# EAGLE design PowerBoard (EAGLE 7.3.0)
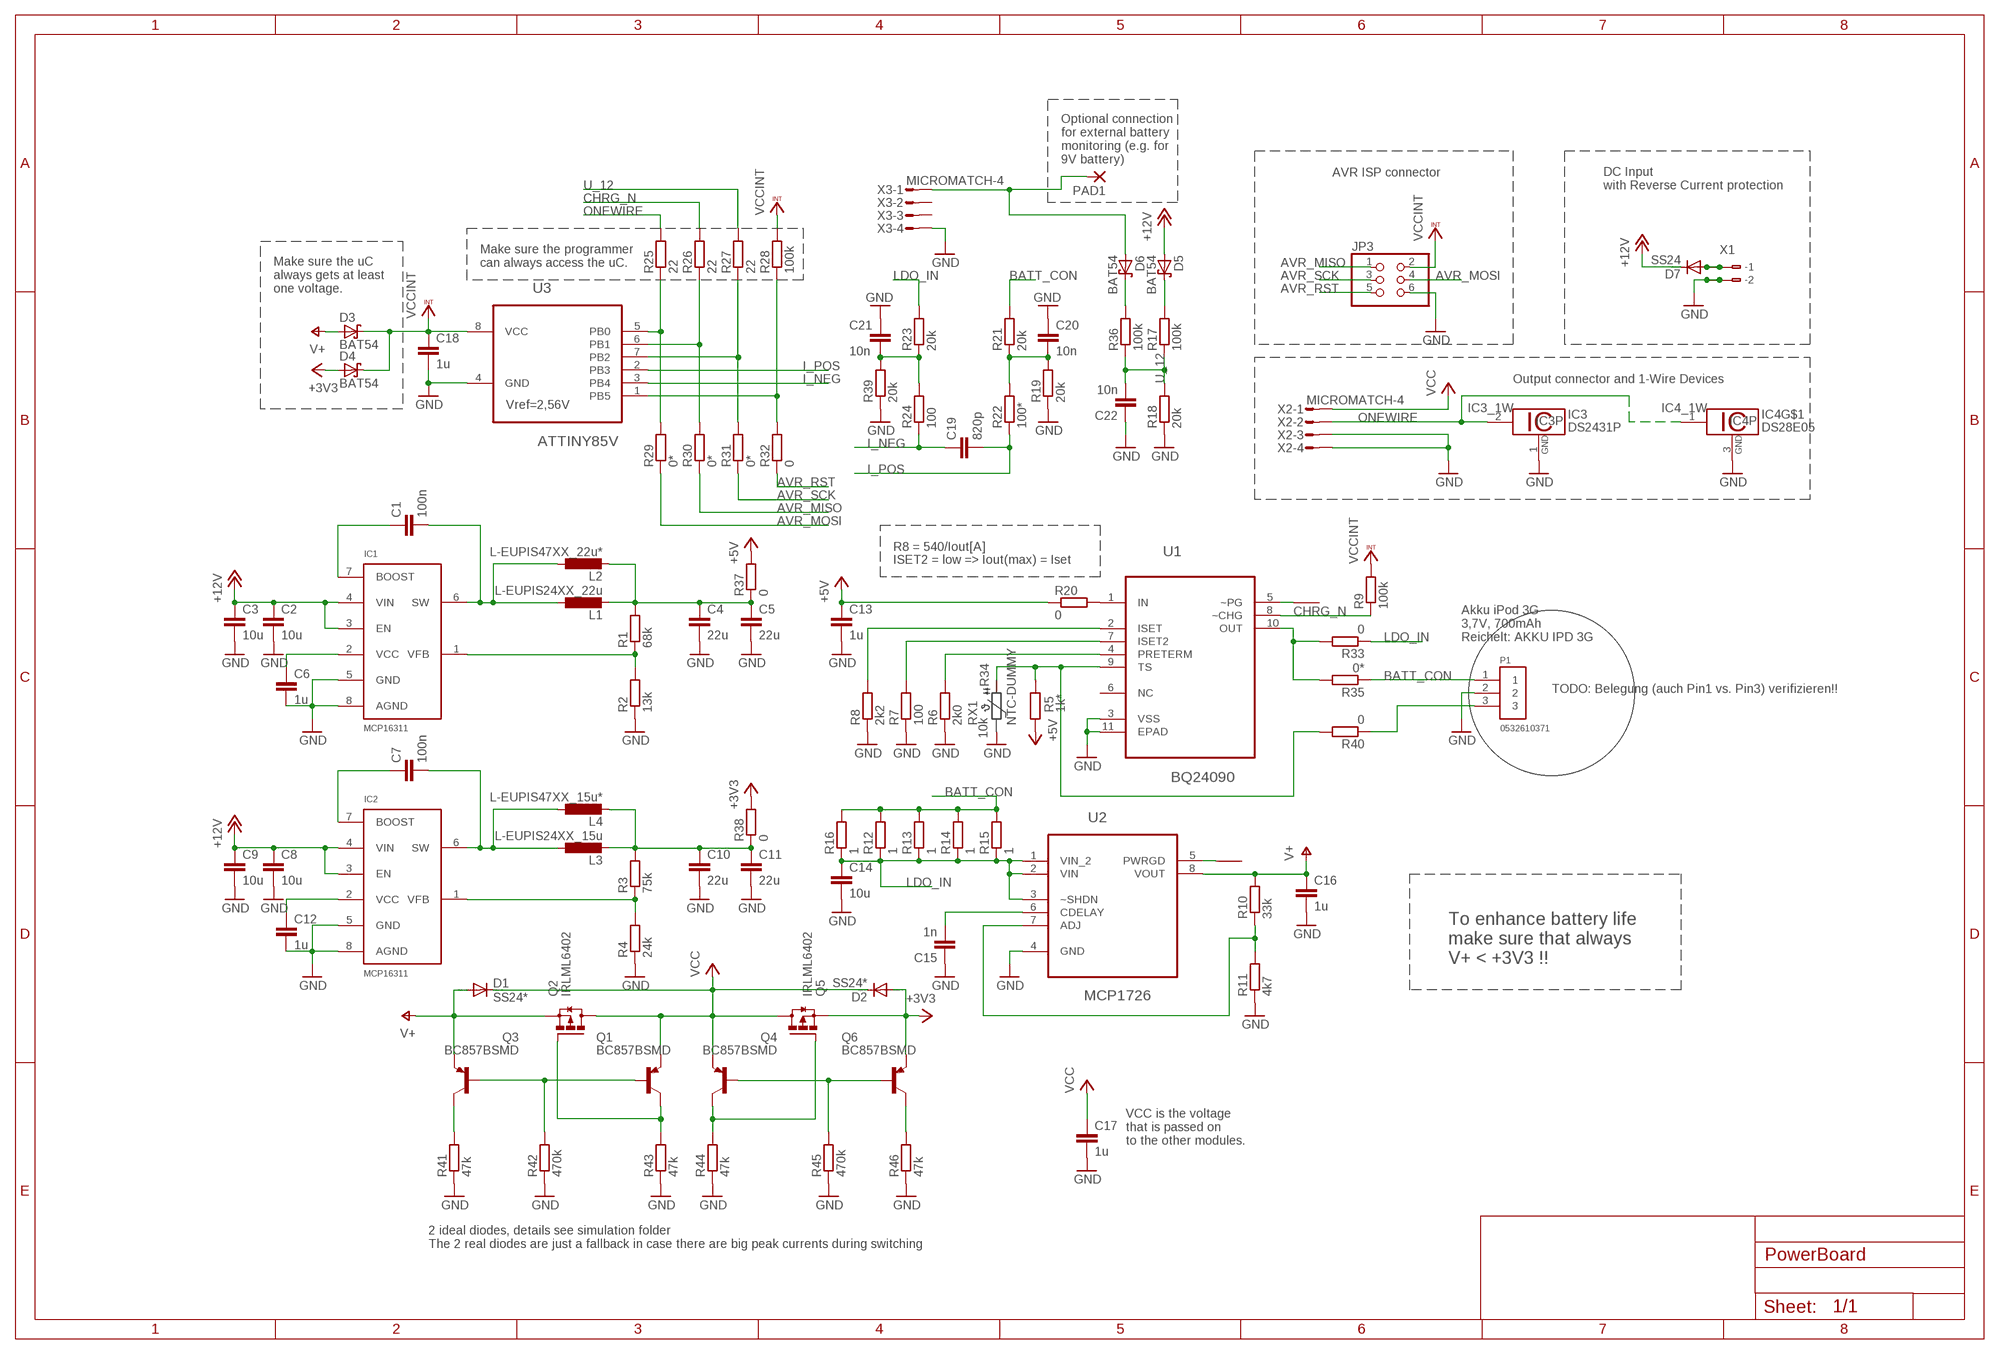
[diagram p0: schematic, sheet 1]

## Parts
C1  100n  C-EUC0603  [C0603]
C2  10u  C-EUC1210  [C1210]
C3  10u  C-EUC1210  [C1210]
C4  22u  C-EUC1210  [C1210]
C5  22u  C-EUC1210  [C1210]
C6  1u  C-EUC0603  [C0603]
C7  100n  C-EUC0603  [C0603]
C8  10u  C-EUC1210  [C1210]
C9  10u  C-EUC1210  [C1210]
C10  22u  C-EUC1210  [C1210]
C11  22u  C-EUC1210  [C1210]
C12  1u  C-EUC0603  [C0603]
C13  1u  C-EUC0603  [C0603]
C14  10u  C-EUC1210  [C1210]
C15  1n  C-EUC0603  [C0603]
C16  1u  C-EUC0603  [C0603]
C17  1u  C-EUC0603  [C0603]
C18  1u  C-EUC0603  [C0603]
C19  820p  C-EUC0603  [C0603]
C20  10n  C-EUC0603  [C0603]
C21  10n  C-EUC0603  [C0603]
C22  10n  C-EUC0603  [C0603]
D1  SS24*  DIODE-SMB  [SMB]
D2  SS24*  DIODE-SMB  [SMB]
D3  BAT54  [SOT23]
D4  BAT54  [SOT23]
D5  BAT54  [SOT23]
D6  BAT54  [SOT23]
D7  SS24  DIODE-SMB  [SMB]
IC1  MCP16311  [SOP65P490X110-8N]
IC2  MCP16311  [SOP65P490X110-8N]
IC3  DS2431P  [TSOC6]
IC4  DS28E05  [SOT23]
JP3  PINHD-2X3  [2X03]
L1  L-EUPIS24XX_22u  L-EUPIS24XX  [PIS24XX]
L2  L-EUPIS47XX_22u*  L-EUPIS47XX  [PIS47XX]
L3  L-EUPIS24XX_15u  L-EUPIS24XX  [PIS24XX]
L4  L-EUPIS47XX_15u*  L-EUPIS47XX  [PIS47XX]
P1  0532610371  [MOLEX_0532610371]
PAD1  WIREPADSMD2,54-5,08  [SMD2,54-5,08]
Q1  BC857BSMD  [SOT23-BEC]
Q2  IRLML6402  [SOT23]
Q3  BC857BSMD  [SOT23-BEC]
Q4  BC857BSMD  [SOT23-BEC]
Q5  IRLML6402  [SOT23]
Q6  BC857BSMD  [SOT23-BEC]
R1  68k  R-EU_R0603  [R0603]
R2  13k  R-EU_R0603  [R0603]
R3  75k  R-EU_R0603  [R0603]
R4  24k  R-EU_R0603  [R0603]
R5  1k*  R-EU_R0603  [R0603]
R6  2k0  R-EU_R0603  [R0603]
R7  100  R-EU_R0603  [R0603]
R8  2k2  R-EU_R0603  [R0603]
R9  100k  R-EU_R0603  [R0603]
R10  33k  R-EU_R0603  [R0603]
R11  4k7  R-EU_R0603  [R0603]
R12  1  R-EU_R0402  [R0402]
R13  1  R-EU_R0402  [R0402]
R14  1  R-EU_R0402  [R0402]
R15  1  R-EU_R0402  [R0402]
R16  1  R-EU_R0402  [R0402]
R17  100k  R-EU_R0603  [R0603]
R18  20k  R-EU_R0603  [R0603]
R19  20k  R-EU_R0603  [R0603]
R20  0  R-EU_R0603  [R0603]
R21  20k  R-EU_R0603  [R0603]
R22  100*  R-EU_R0603  [R0603]
R23  20k  R-EU_R0603  [R0603]
R24  100  R-EU_R0603  [R0603]
R25  22  R-EU_R0402  [R0402]
R26  22  R-EU_R0402  [R0402]
R27  22  R-EU_R0402  [R0402]
R28  100k  R-EU_R0402  [R0402]
R29  0*  R-EU_R0402  [R0402]
R30  0*  R-EU_R0402  [R0402]
R31  0*  R-EU_R0402  [R0402]
R32  0  R-EU_R0402  [R0402]
R33  0  R-EU_R0603  [R0603]
R34  10k  R-EU_R0603  [R0603]
R35  0*  R-EU_R0603  [R0603]
R36  100k  R-EU_R0603  [R0603]
R37  0  R-EU_R0603  [R0603]
R38  0  R-EU_R0603  [R0603]
R39  20k  R-EU_R0603  [R0603]
R40  0  R-EU_R0603  [R0603]
R41  47k  R-EU_R0603  [R0603]
R42  470k  R-EU_R0603  [R0603]
R43  47k  R-EU_R0603  [R0603]
R44  47k  R-EU_R0603  [R0603]
R45  470k  R-EU_R0603  [R0603]
R46  47k  R-EU_R0603  [R0603]
U1  BQ24090  BQ24090DGQT  [SOP50P490X110-11N]
U2  MCP1726  MCP1726-3302E/SN  [SOIC127P490X175-8N]
U3  ATTINY85V  ATTINY85V-10SU  [SOIC127P798X216-8N]
U$1  PAD100-RND  [PAD-100-RND]
U$3  PAD100-RND  [PAD-100-RND]
X1  233-102  [233-102]
X2  MICROMATCH-4  [MICROMATCH-4]
X3  MICROMATCH-4  [MICROMATCH-4]

## Nets
+3V3: D2.A D4.1(A) Q5.2(S) Q6.E R38.2
+5V: C13.1 R5.1 R20.1 R37.2
+12V: C2.1 C3.1 C8.1 C9.1 D5.1(A) D7.C IC1.3(EN) IC1.4(VIN) IC2.3(EN) IC2.4(VIN)
AVR_MISO: JP3.1 R30.1
AVR_MOSI: JP3.4 R29.1
AVR_RST: JP3.5 R32.1
AVR_SCK: JP3.3 R31.1
BATT_CON: P1.1 R12.2 R13.2 R14.2 R15.2 R16.2 R21.2 R35.1
CHRG_N: R9.1 R26.2 U1.8(~CHG)
GND: C2.2 C3.2 C4.2 C5.2 C6.2 C8.2 C9.2 C10.2 C11.2 C12.2 C13.2 C14.2 C15.1 C16.2 C17.2 C18.2 C20.1 C21.1 C22.1 IC1.5(GND) IC1.8(AGND) IC2.5(GND) IC2.8(AGND) IC3.1(GND) IC4.3(P:GND) JP3.6 P1.2 R2.1 R4.1 R6.1 R7.1 R8.1 R11.1 R18.1 R19.1 R34.1 R39.1 R41.1 R42.1 R43.1 R44.1 R45.1 R46.1 U1.3(VSS) U1.11(EPAD) U2.4(GND) U3.4(GND) X1.A2(-2) X1.B2(B-2) X2.3 X2.4 X3.4
I_NEG: C19.1 R24.1 U3.3(PB4)
I_POS: C19.2 R22.1 U3.2(PB3)
LDO_IN: C14.1 R12.1 R13.1 R14.1 R15.1 R16.1 R23.2 R33.1 U2.1(VIN_2) U2.2(VIN) U2.3(~SHDN)
N$1: C1.1 IC1.7(BOOST)
N$2: C1.2 IC1.6(SW) L1.2 L2.2
N$3: U2.5(PWRGD) U$3.P$1
N$4: R8.2 U1.2(ISET)
N$5: IC1.1(VFB) R1.1 R2.2
N$6: R7.2 U1.7(ISET2)
N$7: C6.1 IC1.2(VCC)
N$8: R6.2 U1.4(PRETERM)
N$9: C7.1 IC2.7(BOOST)
N$10: C7.2 IC2.6(SW) L3.2 L4.2
N$11: IC2.1(VFB) R3.1 R4.2
N$12: C12.1 IC2.2(VCC)
N$13: R5.2 R34.2 R40.2 U1.9(TS)
N$14: U1.5(~PG) U$1.P$1
N$15: C15.2 U2.6(CDELAY)
N$16: R28.1 R32.2 U3.1(PB5)
N$17: D6.3(C) R36.2
N$18: R27.1 R31.2 U3.7(PB2)
N$19: R26.1 R30.2 U3.6(PB1)
N$20: R10.1 R11.2 U2.7(ADJ)
N$21: C21.2 R23.1 R24.2 R39.2
N$22: D7.A X1.A1(-1) X1.B1(B-1)
N$23: R25.1 R29.2 U3.5(PB0)
N$24: D6.1(A) PAD1.1(P) X3.1
N$25: C4.1 C5.1 L1.1 L2.1 R1.2 R37.1
N$26: C10.1 C11.1 L3.1 L4.1 R3.2 R38.1
N$27: C20.2 R19.2 R21.1 R22.2
N$28: D5.3(C) R17.2
N$29: R20.2 U1.1(IN)
N$30: R33.2 R35.2 U1.10(OUT)
N$31: P1.3 R40.1
N$33: Q1.C Q2.1(G) R43.2
N$34: Q1.B Q3.B R42.2
N$35: Q3.C R41.2
N$37: Q4.C Q5.1(G) R44.2
N$38: Q4.B Q6.B R45.2
N$39: Q6.C R46.2
ONEWIRE: IC3.2(1W) IC4.1(_1W:1W) R25.2 X2.2
U_12: C22.2 R17.1 R18.2 R27.2 R36.1
V+: C16.1 D1.A D3.1(A) Q2.2(S) Q3.E R10.2 U2.8(VOUT)
VCC: C17.1 D1.C D2.C Q1.E Q2.3(D) Q4.E Q5.3(D) X2.1
VCCINT: C18.1 D3.3(C) D4.3(C) JP3.2 R9.2 R28.2 U3.8(VCC)
Unconnected: U1.6(NC) X3.2 X3.3

## Notes on the sheet
- Optional connection 
  for external battery
  monitoring (e.g. for 
  9V battery)
- AVR ISP connector
- DC Input
  with Reverse Current protection
- Make sure the programmer
  can always access the uC.
- Make sure the uC
  always gets at least
  one voltage.
- Output connector and 1-Wire Devices
- Vref=2,56V
- R8 = 540/Iout[A]
- ISET2 = low => Iout(max) = Iset
- Akku iPod 3G
  3,7V, 700mAh
  Reichelt: AKKU IPD 3G
- TODO: Belegung (auch Pin1 vs. Pin3) verifizieren!!
- To enhance battery life
  make sure that always
  V+ < +3V3 !!
- VCC is the voltage
  that is passed on
  to the other modules.
- 2 ideal diodes, details see simulation folder
  The 2 real diodes are just a fallback in case there are big peak currents during switching

## Library data of the parts
C1-C22 = rcl:C-EU: CAPACITOR, European symbol
D1 D2 D7 = diode:DIODE-: DIODE
D3-D6 = diode:BAT54: Schottky Diodes Source: Fairchild .. BAT54.pdf
IC1 IC2 = mcp16311_SOP65P490X110-8N:MCP16311
IC3 = 1wire:DS2431: 1024-Bit EEPROM This chip provides a 4x256 Bit EEPROM, which can be programmed@5V. Write protection and OTP emulation are available, too. Author: Jan Kandziora <jjj@gmx.de>
IC4 = 1wire:DS28E05
JP3 = pinhead:PINHD-2X3: PIN HEADER
L1-L4 = Inductor-Fastron:L-EU
P1 = 0532610371:0532610371: 1.25mm (.049") Pitch PicoBlade Header, Surface Mount, Right Angle, Lead-free, 3 Circuits; AVAILABILITY: Good; DESCRIPTION: CONN HEADER 3POS 1.25MM R/A SMD; MF: Molex; MP: 0532610371; PACKAGE: None; PRICE: 0.61 USD
PAD1 = wirepad:WIREPAD: Wire PAD connect wire on PCB
Q1 Q3 Q4 Q6 = transistor-pnp:BC857*: PNP Transistror
Q2 Q5 = IRLML6402:IRLML6402: Single P-Channe MOSFET
R1-R46 = rcl:R-EU_: RESISTOR, European symbol
U1 = BQ24090DGQT:BQ24090DGQT: 1A, Single-Input, Single Cell Li-Ion Battery Charger; AVAILABILITY: Good; DESCRIPTION: 1A%2C Single Input%2C Single Cell Li-Ion Battery Charger w/ 10k%3F NTC %7C Li-ion Linear Battery Charger IC 10-MSOP-PowerPAD ...; MF: Texas Instruments; MP: BQ24090DGQT; PACKAGE: MSOP-10 Texas Instruments; PRICE: 0.96 USD
U2 = MCP1726-3302E_SN:MCP1726-3302E/SN: Current LDO Regulator; AVAILABILITY: Good; DESCRIPTION: MCP1726 Series 1 A 3.3 V Fixed Output Surface Mount LDO Regulator - SOIC-8; MF: Microchip; MP: MCP1726-3302E/SN; PACKAGE: SOIC-8 Microchip; PRICE: 0.63 USD
U3 = ATTINY85V-10SU:ATTINY85V-10SU: 8-bit Microcontroller with In-System Programmable Flash; AVAILABILITY: Good; DESCRIPTION: ATtiny Series 10 MHz 8 KB Flash 512 B SRAM 8-Bit Microcontroller - SOIC-8; MF: Atmel; MP: ATTINY85V-10SU; PACKAGE: SOIC-8 Atmel; PRICE: 1.19 USD
U$1 U$3 = Pinoccio:PAD
X1 = con-wago:233-102: WAGO Cage Clamp; MPN: 233-102; OC_FARNELL: unknown; OC_NEWARK: 28K9044
X2 X3 = con-amp-micromatch:MICROMATCH-4: MicroMaTch 4 7-215464-4 / 0-215464-4 Drawing Number C-215464 DDEController.pdf; MPN: 7-215464-4; OC_FARNELL: 3784629; OC_NEWARK: 19R8124

## Board
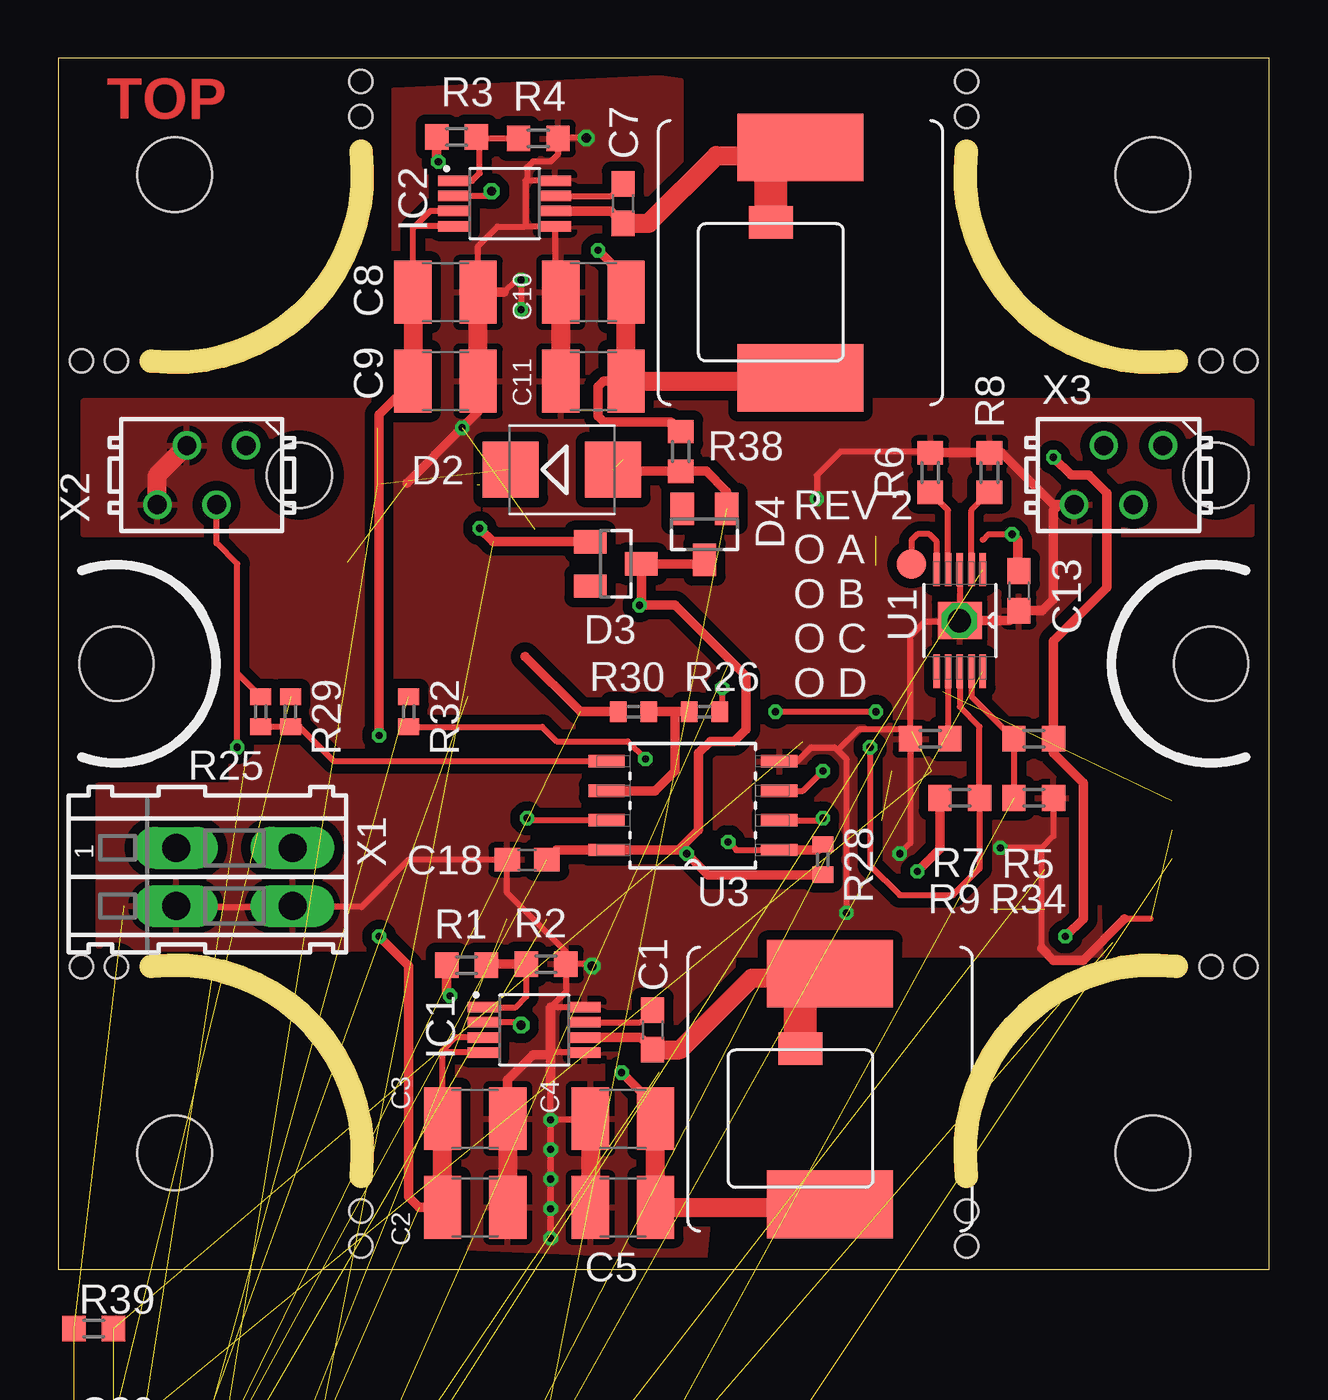
[diagram p1: board, top side]
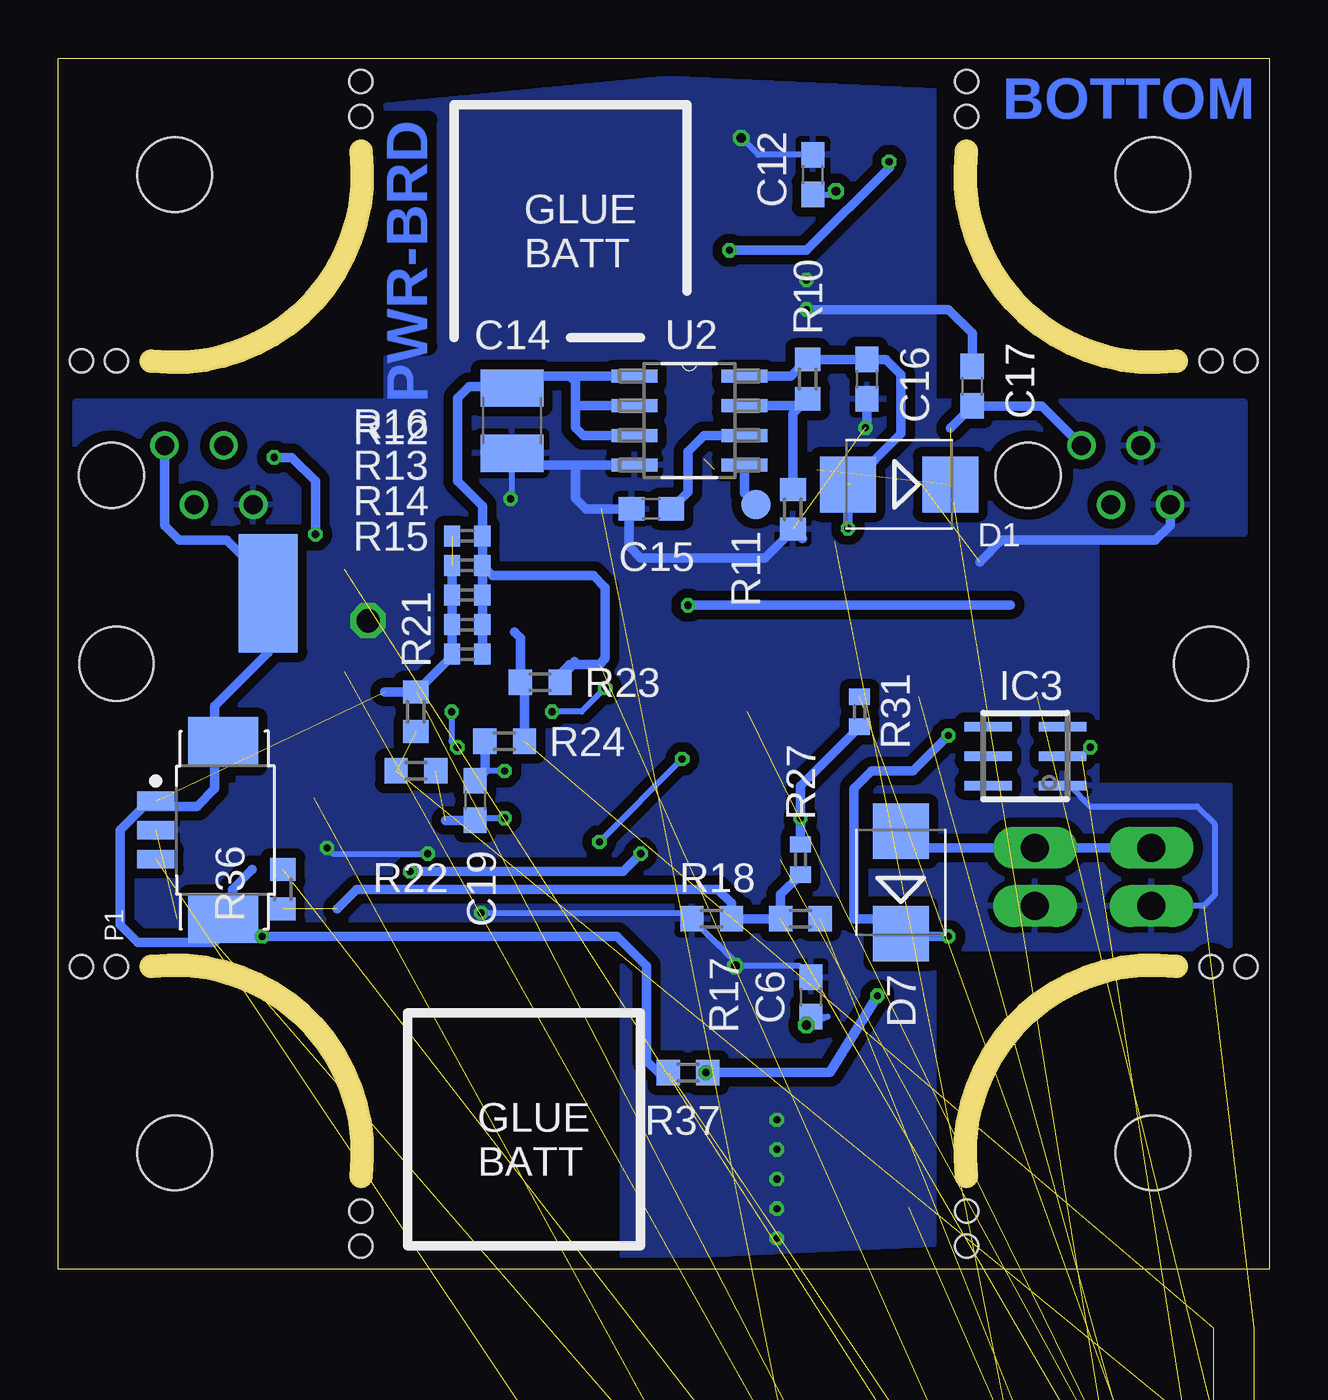
[diagram p2: board, bottom side, seen from below]

Size 52 x 52 mm. Coordinates in mm from the lower left corner, seen from the top.
Outline: 0,0 52,0 52,52 0,52 0,0
Copper layers (1*16): Top 0.035mm / dielectric 1.6mm / Bottom 0.035mm
Design rules "Elecrow_2-layer_PCB_eagle_rule": minimum track width 6mil, minimum drill 12mil, track to track 6mil, track to pad 6mil, pad to pad 6mil, via to via 8mil, smd to smd 0mil, copper to edge 20mil, drill to drill 10mil, minimum pad ring 6mil, minimum via ring 6mil, stop-mask expansion 0mil, vias tented up to drill 100mil, thermal gap 10mil
Holes 3.2 mm at 5,47 47,47 47,5 5,5 2.5,26 49.5,26
Holes 2.8 mm at 10.35,34.1 49.72,34.1
Holes 1 mm at 39,49.5 39,51 49.5,39 51,39 13,49.5 13,51 1,39 2.5,39 1,13 2.5,13 13,1 13,2.5 39,1 39,2.5 51,13 49.5,13
bKeepout: area 35.6,13.3 to 43.2,24.1
Milling: 5 lines

### Footprints (pad centres in the part's own frame; a part is rotated, then mirrored left to right if it is on the bottom)
C0603 = smd 1.1 x 1: 1 -0.85,0; 2 0.85,0
C1210 = smd 1.6 x 2.7: 1 -1.4,0; 2 1.4,0
SMB = smd 2.4 x 2.4: A 2.2,0; C -2.2,0
SOT23 = smd 1 x 1.4: 1 -0.95,-1.1; 2 0.95,-1.1; 3 0,1.1
SOP65P490X110-8N = smd 1.38 x 0.45: 1 -2.165,0.975; 2 -2.165,0.325; 3 -2.165,-0.325; 4 -2.165,-0.975; 5 2.165,-0.975; 6 2.165,-0.325; 7 2.165,0.325; 8 2.165,0.975
TSOC6 = smd 0.406 x 2.032: 1 -1.27,-1.6; 2 0,-1.6; 3 1.27,-1.6; 4 1.27,1.6; 5 0,1.6; 6 -1.27,1.6
2X03 = drill 1.016 octagon: 1 -2.54,-1.27; 2 -2.54,1.27; 3 0,-1.27; 4 0,1.27; 5 2.54,-1.27; 6 2.54,1.27
PIS24XX = smd 1.4 x 1.9: 1 -3,0; 2 3,0
PIS47XX = smd 2.9 x 5.4: 1 -4.95,0; 2 4.95,0
MOLEX_0532610371 = smd 0.8 x 1.6: 1 1.25,0; 2 0,0; 3 -1.25,0 | smd 2.1 x 3: 4 -3.8,-2.9; 5 3.8,-2.9
SMD2,54-5,08 = smd 2.54 x 5.08: 1 0,0
SOT23-BEC = smd 1 x 1.4: B -0.95,-1.1; C 0,1.1; E 0.95,-1.1
R0603 = smd 1 x 1.1: 1 -0.85,0; 2 0.85,0
R0402 = smd 0.7 x 0.9: 1 -0.65,0; 2 0.65,0
SOP50P490X110-11N = smd 1.422 x 0.279: 1 -2.184,0.991; 2 -2.184,0.508; 3 -2.184,0; 4 -2.184,-0.508; 5 -2.184,-0.991; 6 2.184,-0.991; 7 2.184,-0.508; 8 2.184,0; 9 2.184,0.508; 10 2.184,0.991 | smd 1.575 x 1.88: 11 0,0
SOIC127P490X175-8N = smd 1.981 x 0.559: 1 -2.362,1.905; 2 -2.362,0.635; 3 -2.362,-0.635; 4 -2.362,-1.905; 5 2.362,-1.905; 6 2.362,-0.635; 7 2.362,0.635; 8 2.362,1.905
SOIC127P798X216-8N = smd 1.549 x 0.533: 1 -3.708,1.905; 2 -3.708,0.635; 3 -3.708,-0.635; 4 -3.708,-1.905; 5 3.708,-1.905; 6 3.708,-0.635; 7 3.708,0.635; 8 3.708,1.905
PAD-100-RND = smd 1.27 x 1.27: P$1 0,0
233-102 = drill 1.2 long: A1 -1.25,2.5; A2 1.25,2.5; B1 -1.25,-2.5; B2 1.25,-2.5
MICROMATCH-4 = drill 0.813: 1 1.905,1.27; 2 0.635,-1.27; 3 -0.635,1.27; 4 -1.905,-1.27

### Placement (x,y rotation side)
C1  25.52,10.28 270 top
C2  17.9,2.66 0 top
C3  17.9,6.47 0 top
C4  24.25,6.47 180 top
C5  24.25,2.66 180 top
C6  19.68,11.69 90 bottom
C7  24.25,45.76 270 top
C8  16.63,41.95 0 top
C9  16.63,38.14 0 top
C10  22.98,41.95 180 top
C11  22.98,38.14 180 top
C12  19.6,47 90 bottom
C13  41.25,29.13 270 top
C14  32.52,36.44 270 bottom
C15  26.54,32.65 0 bottom
C16  17.28,38.22 270 bottom
C17  12.76,37.92 90 bottom
C18  20.13,17.59 180 top
C19  34.1,20.13 270 bottom
C20  1.52,-7.37 0 top  (outside the outline)
C21  1.52,-12.19 0 top  (outside the outline)
C22  1.52,-17.02 0 top  (outside the outline)
D1  15.89,33.7 180 bottom
D2  21.63,34.33 0 top
D3  23.94,30.29 270 top
D4  27.75,31.56 180 top
D5  2.54,-27.94 0 top  (outside the outline)
D6  2.54,-35.31 0 top  (outside the outline)
D7  15.82,16.61 90 bottom
IC1  20.44,10.28 0 top
IC2  19.17,45.76 0 top
IC3  10.48,22.04 90 bottom
IC4  -5.71,-71.75 0 top  (outside the outline)
JP3  -4.06,-34.04 0 top  (outside the outline)
L1  31.87,6.47 90 top
L2  33.14,7.74 90 top
L3  30.6,41.95 90 top
L4  31.87,43.22 90 top
P1  47.82,18.86 90 bottom
PAD1  42.99,29.02 180 bottom
Q1  -5.71,-79.38 0 top  (outside the outline)
Q2  -5.71,-87 0 top  (outside the outline)
Q3  -5.71,-94.61 0 top  (outside the outline)
Q4  -5.71,-117.47 0 top  (outside the outline)
Q5  -5.71,-135.25 0 top  (outside the outline)
Q6  -5.71,-142.88 0 top  (outside the outline)
R1  17.53,13.06 180 top
R2  20.95,13.11 180 top
R3  17.11,48.62 180 top
R4  20.61,48.55 180 top
R5  41.88,22.78 180 top
R6  37.44,34.21 270 top
R7  37.44,22.78 0 top
R8  39.98,34.21 270 top
R9  38.71,20.24 180 top
R10  19.82,38.22 90 bottom
R11  20.45,32.63 90 bottom
R12  34.44,30.22 180 bottom
R13  34.44,28.95 180 bottom
R14  34.44,27.68 180 bottom
R15  34.44,26.41 180 bottom
R16  34.44,31.49 180 bottom
R17  20.13,15.05 0 bottom
R18  23.94,15.05 0 bottom
R19  1.52,-21.84 0 top  (outside the outline)
R20  -6.86,-41.4 0 top  (outside the outline)
R21  36.64,23.94 90 bottom
R22  36.64,21.4 180 bottom
R23  31.31,25.21 0 bottom
R24  32.83,22.67 0 bottom
R25  8.7,23.94 90 top
R26  27.75,23.94 0 top
R27  20.13,17.59 270 bottom
R28  32.83,17.59 270 top
R29  9.97,23.94 270 top
R30  24.7,23.94 0 top
R31  17.59,23.94 270 bottom
R32  15.05,23.94 270 top
R33  -6.86,-55.88 0 top  (outside the outline)
R34  41.88,20.24 180 top
R35  -6.86,-60.71 0 top  (outside the outline)
R36  42.35,16.32 90 bottom
R37  24.96,8.45 180 bottom
R38  26.73,35.12 270 top
R39  1.52,-2.54 0 top
R40  -6.86,-65.53 0 top  (outside the outline)
R41  -6.35,-100.97 0 top  (outside the outline)
R42  -6.35,-106.05 0 top  (outside the outline)
R43  -6.35,-111.12 0 top  (outside the outline)
R44  -6.35,-123.83 0 top  (outside the outline)
R45  -6.35,-128.91 0 top  (outside the outline)
R46  -6.35,-149.22 0 top  (outside the outline)
U1  38.71,27.86 270 top
U2  24.9,36.44 0 bottom
U3  27.25,19.91 180 top
U$1  36.64,30.29 0 top
U$3  22.04,32.83 0 bottom
X1  7.56,16.85 270 top
X2  6.16,34.1 0 top
X3  45.53,34.1 0 top

### Tracks (layer width: path | path; a pad name or v marks a point on that pad's centre or on a via)
+3V3  (3 unrouted)
  Top 0.406: 24.38,34.88 24.28,34.78 24.79,34.27 R38.2 27.84,34.27 28.7,33.4 D4.1
+5V  (via drill 0.3)  (1 unrouted)
  Top 0.254: 39.7,31.32 39.94,31.56 v40.96,31.56
  Top 0.406: v40.96,31.56 41.21,31.31 41.21,30.02 C13.1 | v42.74,34.86 43.5,34.1 44.26,34.1 45.02,33.34 45.02,29.27 42.73,26.99 R5.1 42.73,22.16 44.01,20.89 44.01,15.05 v43.24,14.29
  Bottom 0.406: v42.74,34.86 41.97,34.86 40.96,33.85 v40.96,31.56 | v43.24,14.29 28,14.29 26.73,13.02 26.73,8.95 26.23,8.45 R37.2
+12V  (via drill 0.3)  (1 unrouted)
  Top 0.254: IC2.3 15.97,45.44 15.32,44.78 | 15.32,44.78 15.23,44.69 C8.1 | IC2.4 15.32,44.78 | IC1.3 17.07,9.96 16.5,9.39 16.5,9.21 | C3.1 16.5,9.21 | IC1.4 16.6,9.3 16.5,9.21
  Top 0.406: C2.1 15.5,2.66 15.05,3.11 15.05,13.02 v13.78,14.29 | C9.1 13.78,36.69 v13.78,22.92
  Top 0.813: C8.1 C9.1 | C2.1 C3.1
  Bottom 0.406: v13.78,14.29 15.7,14.29 D7.C 16.46,15.05 17.84,15.05 17.84,20.64 17.08,21.4 15.3,21.4 v13.78,22.92
AVR_MISO  (1 unrouted)
  Top 0.406: 20.05,26.3 22.42,23.94 R30.1
AVR_MOSI  (1 unrouted)
  Top 0.254: 9.89,24.67 R29.1
AVR_RST  (1 unrouted)
  Top 0.254: 14.97,24.67 R32.1
AVR_SCK  (1 unrouted)
  Bottom 0.406: 17.51,24.67 R31.1
BATT_CON  (3 unrouted)
  Bottom 0.406: R12.2 R13.2 R14.2 R15.2 35.09,26.34 R21.2 37.98,24.79
CHRG_N  (via drill 0.3)
  Top 0.254: U1.8 38.71,24.16 39.56,23.31 R9.1 39.56,17.21 38.42,16.07 36.13,16.07 34.86,17.34 v34.86,22.42 | R26.2 28.51,24.05 v28.51,24.96 | v30.8,23.94 v35.12,23.94
  Bottom 0.254: v28.51,24.96 29.53,23.94 v30.8,23.94 | v35.12,23.94 35.12,22.67 v34.86,22.42
GND  (via drill 0.3, 0.4, 1)  (16 unrouted)
  Top 0.254: C10.2 21.34,42.2 IC2.5 20.07,44.78 | IC2.8 20.07,46.73 | 20.07,46.73 20.07,44.78 | 20.07,46.73 20.13,46.8 20.13,47.31 20.38,47.56 21.15,47.56 21.46,47.88 R4.1 21.49,48.58 v22.67,48.58 | C8.2 18.03,43.94 18.86,44.77 20.05,44.77 20.07,44.78 | U1.3 U1.11 38.71,27.79 | 38.71,27.79 v38.7,27.85 | IC1.8 21.15,11.26 21.8,11.91 R2.1 | IC1.5 21.15,9.3 | v22.92,13.02 22.84,13.11 R2.1 | X1.B2 5.1,15.56 10.1,15.56 | C18.2 15.05,17.59 13.02,15.56 10.1,15.56 | C18.2 19.37,17.5 | R2.1 21.8,13.64 19.28,16.15 C18.2 | U3.4 31.72,21.82 32.32,22.42 33.34,22.42 33.47,22.29 | 33.47,22.29 33.85,21.91 v33.85,15.3 | 40.7,18.1 v40.45,18.1 42.23,18.1 | R34.1 42.73,18.61 42.23,18.1 | 38.71,27.79 37.19,27.79 36.59,27.19 R7.1 | R7.1 36.59,18.3 v36.13,17.84 | R6.1 37.38,35.12 33.59,35.12 32.58,34.1 v32.58,33.08 | R7.1 36.19,23.18 34.35,23.18 33.47,22.29 | 46.91,15.05 45.78,15.05 | 42.23,13.78 42.23,18.1 | 10.1,15.56 X1.A2 | 22.61,6.47 22.56,6.41 v21.15,6.41 v21.15,5.14 v21.15,3.87 v21.15,2.6 v21.15,1.33 21.15,7.94 | 19.14,41.95 19.67,42.48 v19.88,42.48 v19.88,41.21
  Top 0.406: R6.1 R8.1 40.51,35.06 42.74,32.83 42.99,32.83 | X3.4 42.99,32.83 | 42.99,32.83 42.74,32.58 42.74,28.77 42.25,28.28 C13.2 40.83,27.86 U1.11 | 21.15,11.26 21.15,9.3 21.15,9.21 | C4.2 22.61,6.47 | 21.15,7.94 21.15,9.21 | C3.2 19.3,8.12 20.38,9.21 21.15,9.21 | C9.2 18.03,36.83 v17.34,36.13 14.97,33.77 | 19.14,41.95 C8.2 | 45.78,15.05 44.01,13.27 42.74,13.27 42.23,13.78
  Top 0.813: C11.2 C10.2 | C9.2 C8.2 | X2.4 4.25,34.1 X2.3 | C4.2 C5.2 | C3.2 C2.2
  Bottom 0.254: C12.2 21.94,47.85 v22.67,48.58 | C6.2 20.15,13.02 v22.92,13.02 22.76,13.02 R18.1 25.04,15.3 v33.85,15.3 | v40.45,18.1 40.2,17.84 v36.13,17.84 | v32.58,33.08 32.52,33.14 C14.2 | IC3.1 8.57,20.77 7.68,19.88 3.11,19.88 2.35,19.11 2.35,16.07 2.82,15.6 X1.B2
  Bottom 0.406: U2.4 29.78,34.53 | 29.78,34.53 32.02,34.53 C14.2 | 29.78,34.53 29.78,33.08 29.35,32.65 C15.1 27.5,32.54 27.5,31.05 26.99,30.54 21.65,30.54 20.45,31.74 R11.1 20.05,31.38 | C16.2 17.28,36.19 v17.34,36.13 | 12.43,30.37 11.49,31.31 4.89,31.31 4.25,31.94 X2.4 | C17.2 12.76,40.19 13.78,41.21 v19.88,41.21
  pour Top (isolate 0.406): 1.08,31.56 7.43,31.56 7.43,20.77 1.72,20.77 1.72,13.78 14.41,13.78 14.41,1.08 27.11,0.54 27.75,0.41 29.02,13.53 44.77,13.53 44.51,20.77 44.26,20.77 44.26,31.56 51.24,31.56 51.24,37.27 26.73,37.27 26.73,51.02 25.84,51.15 14.41,50.61 14.41,37.27 1.08,37.27
  pour Bottom (isolate 0.406): 1.08,37.27 1.08,31.56 7.43,31.56 7.43,20.77 1.72,20.77 1.72,13.78 14.41,13.78 14.41,1.08 25.84,0.54 27.75,0.54 27.75,13.78 50.61,13.78 50.61,20.77 44.26,20.77 44.26,31.56 51.24,31.56 51.24,37.27 37.91,37.27 37.91,49.98 25.84,51.15 14.41,50.61 14.41,37.27
I_NEG  (via drill 0.3)
  Top 0.254: U3.3 31.98,20.55 v32.83,21.4
  Bottom 0.254: v32.83,21.4 33.68,21.4
  Bottom 0.406: R24.1 33.68,21.4 C19.1
I_POS  (via drill 0.3)  (1 unrouted)
  Top 0.254: U3.2 32.74,19.27 v32.83,19.37
  Bottom 0.254: v32.83,19.37 34.01,19.37 C19.2
  Bottom 0.406: C19.2 35.37,19.28
LDO_IN  (1 unrouted)
  Bottom 0.406: 30.04,38.34 32.02,38.34 C14.1 32.59,37.91 34.35,37.91 34.86,37.4 34.86,33.85 33.79,32.77 R16.1 R15.1 R14.1 R13.1 R12.1 | 30.04,38.34 U2.1 | U2.3 29.45,35.8 29.78,36.13 29.78,37.15 | 29.78,37.15 29.78,38.09 30.04,38.34 | U2.2 29.71,37.08 29.78,37.15 | R12.1 33.79,31.25 | 29.82,26.09 R23.2 30.71,25.3 30.04,25.97 28.77,25.97 28.51,26.23 28.51,29.27 29.02,29.78 33.35,29.78 R12.1
N$1
  Top 0.254: IC1.7 25,10.61 C1.1
N$2
  Top 0.406: IC1.6 25,9.96 C1.2
  Top 0.813: C1.2 26.7,9.43 29.78,12.51 32.58,12.51 | 32.58,12.51 32.96,12.51 L2.2 | 31.87,11.8 32.58,12.51
  Top 1.422: L1.2 31.87,11.8
N$3
  Bottom 0.406: U2.5 22.54,33.33 U$3.P$1
N$4
  Top 0.254: U1.2 39.22,32.6 R8.2
N$5
  Top 0.254: IC1.1 19.64,11.26 20.1,11.72 R2.2
  Top 0.406: R2.2 18.43,13.11 R1.1
N$6
  Top 0.254: U1.7 38.2,22.87 R7.2
N$7  (via drill 0.4)
  Top 0.254: v19.88,10.48 19.75,10.61 IC1.2
  Bottom 0.254: C6.1 18.97,10.84 v19.88,10.48
N$8
  Top 0.254: U1.4 38.2,32.6 R6.2
N$9
  Top 0.254: IC2.7 23.73,46.09 C7.1
N$10
  Top 0.406: IC2.6 23.73,45.44 C7.2
  Top 0.813: C7.2 25.35,44.91 28.26,47.82 31.05,47.82 | 31.05,47.82 31.52,47.82 L4.2 | 30.6,47.36 31.05,47.82
  Top 1.422: L3.2 30.6,47.36
N$11
  Top 0.254: R4.2 18.02,48.55 R3.1 18.1,48.48 18.1,47.05 17.78,46.73 IC2.1
N$12  (via drill 0.4)
  Top 0.254: v18.61,46.29 18.4,46.09 IC2.2
  Bottom 0.254: C12.1 18.75,46.15 v18.61,46.29
N$13  (1 unrouted)
  Top 0.254: U1.9 39.22,24.6 R5.2 R34.2
N$14
  Top 0.254: U1.5 37.72,31.24 37.4,31.56 36.89,31.56 36.64,31.31 U$1.P$1
N$15
  Bottom 0.406: U2.6 24.27,35.8 24.96,35.12 24.96,33.38 C15.2
N$16  (via drill 0.3)
  Top 0.254: R32.2 20.78,23.29 21.4,22.67 24.45,22.67 v25.21,21.91 | v28.77,18.35 29.11,18 U3.1
  Top 0.406: U3.1 32.59,18 R28.1
  Bottom 0.254: v25.21,21.91 v28.77,18.35
N$17  (1 unrouted)
N$18  (via drill 0.3)
  Top 0.254: U3.7 20.22,19.27 v20.13,19.37
  Bottom 0.406: R27.1 v20.13,19.37 20.13,20.75 R31.2
N$19
  Top 0.406: R30.2 26.48,23.94 | 26.48,23.94 R26.1 | U3.6 25.62,20.55 26.48,21.4 26.48,23.94
N$20
  Bottom 0.406: U2.7 20.11,37.08 R10.1 20.45,36.73 R11.2
N$21  (2 unrouted)
  Bottom 0.406: R24.2 31.98,24.78 R23.1 32.16,27.11 32.41,27.36
N$22
  Bottom 0.406: D7.A 15.11,18.1 X1.A1 X1.B1
N$23
  Top 0.254: U3.5 11.84,21.82 10.37,23.29 R29.2 R25.1
N$24  (1 unrouted)
  Bottom 0.406: X3.1 47.44,31.94 46.8,31.31 44.77,31.31 42.99,29.53 PAD1.1 42.99,26.48 45.28,24.19 45.28,20.64 46.04,19.88 48.32,19.88 49.34,18.86 49.34,14.8 48.58,14.03 45.28,14.03 44.51,14.8 44.51,16.32 43.66,17.17
N$25  (via drill 0.3)
  Top 0.406: v24.19,8.45 25.65,6.99 C4.1 | R1.2 16.68,11.89 v16.83,11.75
  Top 0.813: L2.1 32.55,2.79 L1.1 31.06,2.66 C5.1 C4.1
  Bottom 0.406: R37.1 v24.19,8.45 18.86,8.45 v16.83,11.75
N$26  (via drill 0.3)
  Top 0.406: C11.1 23.41,38.14 23.18,37.91 23.18,36.64 23.43,36.39 26.31,36.39 R38.1 | C10.1 24.38,42.55 v23.18,43.75 | R3.2 16.26,47.63 v16.32,47.56
  Top 0.813: L4.1 31.28,38.27 30.96,38.59 | 30.96,38.59 L3.1 | 30.96,38.59 30.52,38.14 C11.1 C10.1
  Bottom 0.406: v23.18,43.75 19.88,43.75 16.32,47.31 v16.32,47.56
N$27  (3 unrouted)
N$28  (1 unrouted)
N$29  (1 unrouted)
N$30  (2 unrouted)
N$31  (1 unrouted)
N$33  (2 unrouted)
N$34  (2 unrouted)
N$35  (1 unrouted)
N$37  (2 unrouted)
N$38  (2 unrouted)
N$39  (1 unrouted)
ONEWIRE  (via drill 0.3)  (1 unrouted)
  Top 0.254: R25.2 7.68,25.61 | 7.68,25.61 7.68,30.29 6.79,31.18 X2.2 | v7.68,22.42 7.68,25.61
  Bottom 0.254: IC3.2 8.06,22.04 v7.68,22.42
U_12  (2 unrouted)
  Bottom 0.406: R27.2 20.98,16.09 R17.1 R18.2 23.09,15.72 23.69,16.32 39.18,16.32 40.03,15.47
V+  (via drill 0.3)  (4 unrouted)
  Top 0.406: D3.1 18.67,31.24 v18.1,31.81
  Bottom 0.406: U2.8 20.54,38.34 R10.2 C16.1 16.46,39.07 15.81,38.42 15.81,35.88 17.99,33.7 | v18.1,31.81 D1.A
VCC  (6 unrouted)
  Bottom 0.406: 13.7,36.13 C17.1 9.76,37.07 X2.1
VCCINT  (via drill 0.3)  (1 unrouted)
  Top 0.406: U3.8 21.39,18 C18.1 | U3.8 26.83,18 v26.99,17.84 27.89,16.94 R28.2 | U3.8 26.64,18 27.5,18.86 27.5,22.16 28,22.67 29.02,22.67 29.53,23.18 29.53,25.46 26.48,28.51 v24.96,28.51 25.04,28.6 D3.3 27.58,30.29 D4.3 | R9.2 37.86,18.05 v36.89,17.08
  Bottom 0.406: 11.12,28.51 v24.96,28.51 | v36.89,17.08 27.75,17.08 v26.99,17.84

### Text on the board
Top: TOP
Bottom: BOTTOM | PWR-BRD
tPlace: REV 2 / O A / O B / O C / O D
bPlace: GLUE / BATT | GLUE / BATT
tValues: - +